# EAGLE design AVC_1_0 (EAGLE 8.3.2)
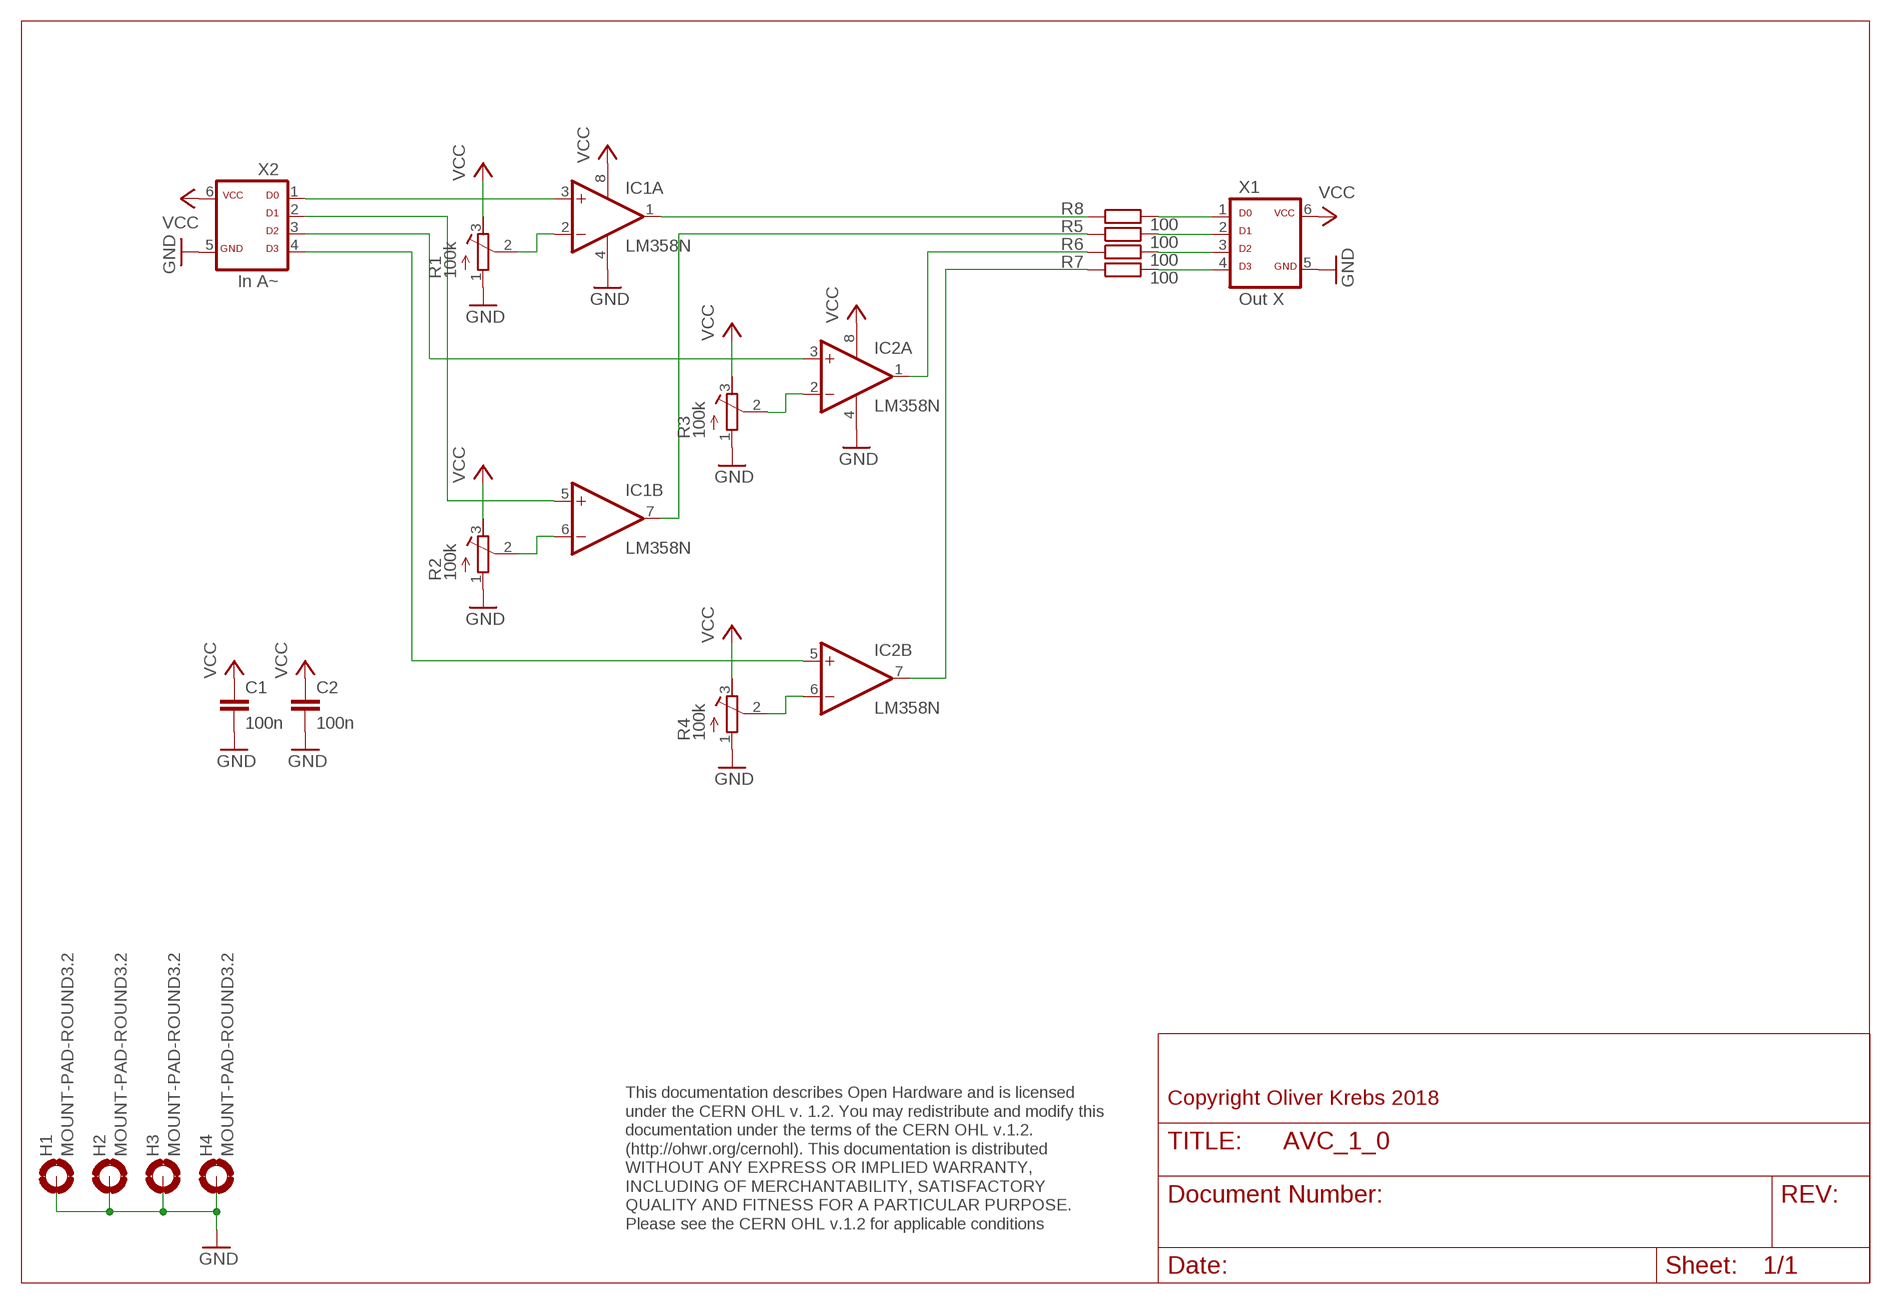
[diagram p0: schematic, sheet 1]

## Parts
C1  100n  C-EU050-025X075  [C050-025X075]
C2  100n  C-EU050-025X075  [C050-025X075]
H1  MOUNT-PAD-ROUND3.2  [3,2-PAD]
H2  MOUNT-PAD-ROUND3.2  [3,2-PAD]
H3  MOUNT-PAD-ROUND3.2  [3,2-PAD]
H4  MOUNT-PAD-ROUND3.2  [3,2-PAD]
IC1  LM358N  [DIL08]
IC2  LM358N  [DIL08]
R1  100k  R-TRIMMACP  [ACP-6L]
R2  100k  R-TRIMMACP  [ACP-6L]
R3  100k  R-TRIMMACP  [ACP-6L]
R4  100k  R-TRIMMACP  [ACP-6L]
R5  100  R-EU_0207/10  [0207/10]
R6  100  R-EU_0207/10  [0207/10]
R7  100  R-EU_0207/10  [0207/10]
R8  100  R-EU_0207/10  [0207/10]
X1  Out X  ML6D  [ML-6]
X2  In A~  ML6D  [ML-6]

## Nets
GND: C1.2 C2.2 H1.B3,2(MOUNT) H2.B3,2(MOUNT) H3.B3,2(MOUNT) H4.B3,2(MOUNT) IC1.4(P:V-) IC2.4(P:V-) R1.1(A) R2.1(A) R3.1(A) R4.1(A) X1.5 X2.5
N$1: IC1.3(A:+IN) X2.1
N$2: IC1.2(A:-IN) R1.2(S)
N$3: IC1.5(B:+IN) X2.2
N$4: IC1.6(B:-IN) R2.2(S)
N$5: R5.2 X1.2
N$6: R8.2 X1.1
N$7: R6.2 X1.3
N$8: R7.2 X1.4
N$9: IC1.1(A:OUT) R8.1
N$10: IC1.7(B:OUT) R5.1
N$11: IC2.3(A:+IN) X2.3
N$12: IC2.2(A:-IN) R3.2(S)
N$13: IC2.5(B:+IN) X2.4
N$14: IC2.6(B:-IN) R4.2(S)
N$15: IC2.1(A:OUT) R6.1
N$16: IC2.7(B:OUT) R7.1
VCC: C1.1 C2.1 IC1.8(P:V+) IC2.8(P:V+) R1.3(E) R2.3(E) R3.3(E) R4.3(E) X1.6 X2.6

## Notes on the sheet
- Copyright Oliver Krebs 2018
- This documentation describes Open Hardware and is licensed 
  under the CERN OHL v. 1.2. You may redistribute and modify this 
  documentation under the terms of the CERN OHL v.1.2. 
  (http://ohwr.org/cernohl). This documentation is distributed
  WITHOUT ANY EXPRESS OR IMPLIED WARRANTY, 
  INCLUDING OF MERCHANTABILITY, SATISFACTORY 
  QUALITY AND FITNESS FOR A PARTICULAR PURPOSE. 
  Please see the CERN OHL v.1.2 for applicable conditions

## Library data of the parts
C1 C2 = 01-my_rcl:C-EU: CAPACITOR, European symbol
H1-H4 = holes:MOUNT-PAD-ROUND: MOUNTING PAD, round
IC1 IC2 = 01-my-linear:LM358: OP AMP also LM158; LM258; LM2904 Source: http://cache.national.com/ds/LM/LM158.pdf
R1-R4 = 01-my_rcl:R-TRIMM: Trimm resistor
R5-R8 = 01-my_rcl:R-EU_: RESISTOR, European symbol
X1 X2 = 01-my-con:ML6D

## Board
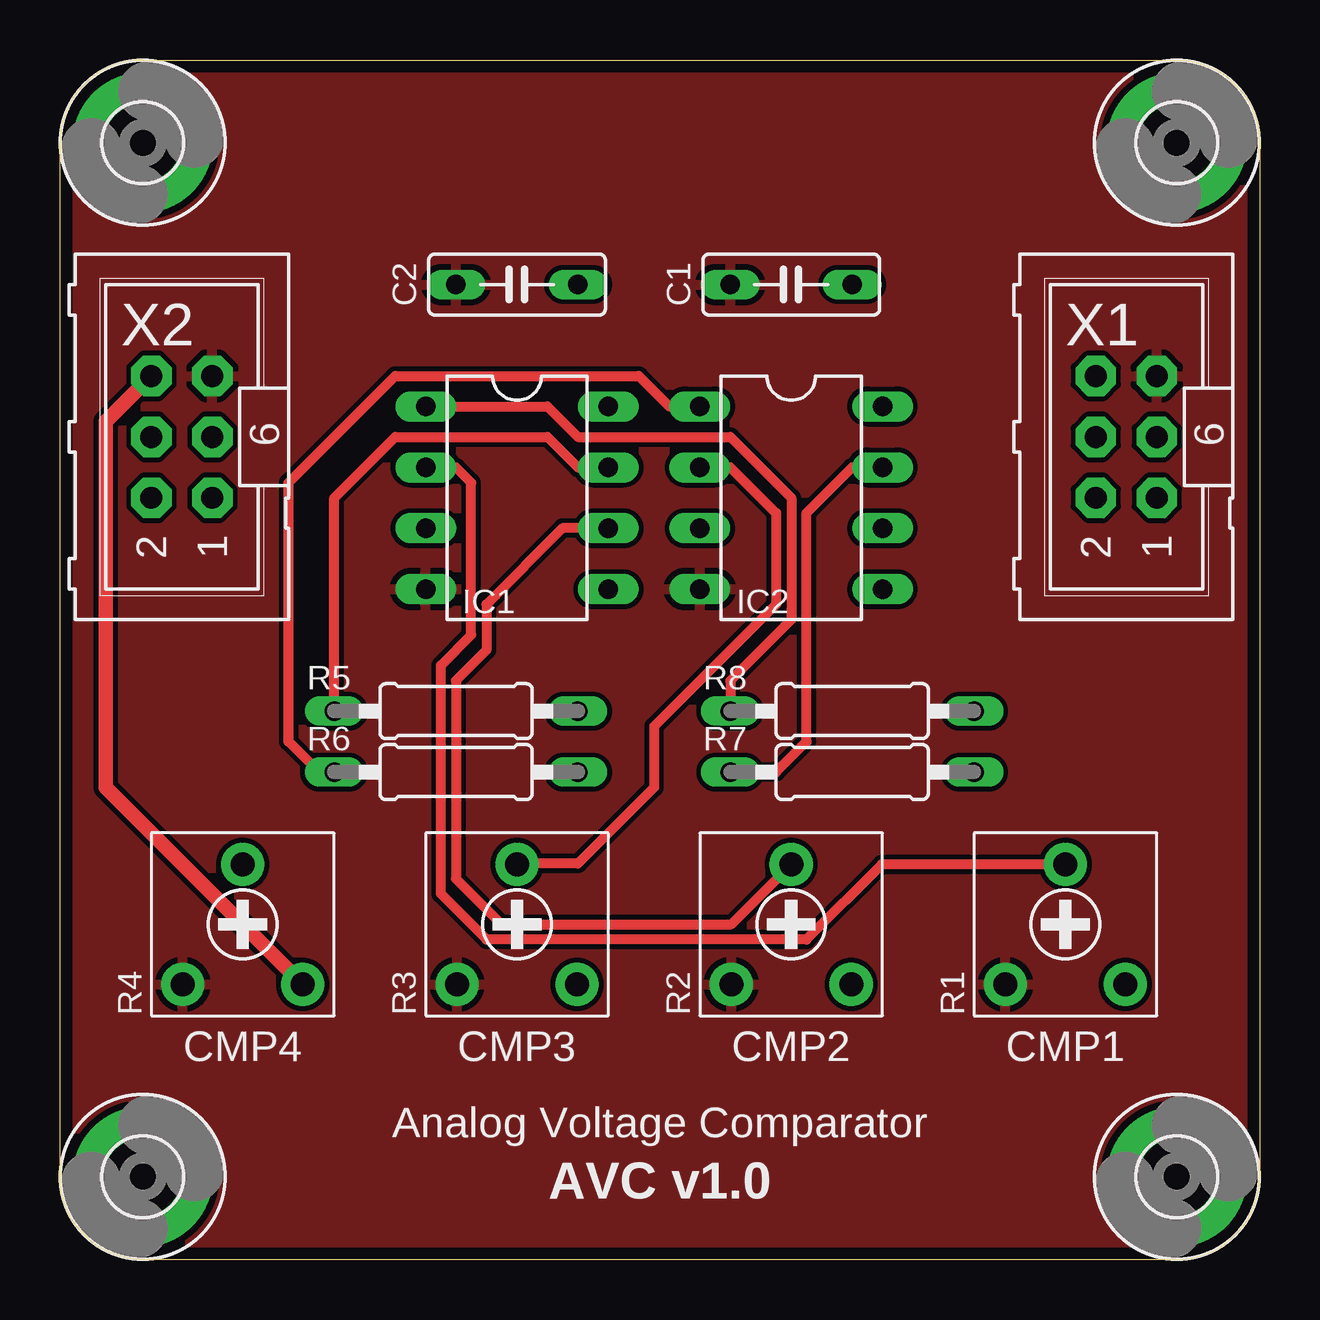
[diagram p1: board, top side]
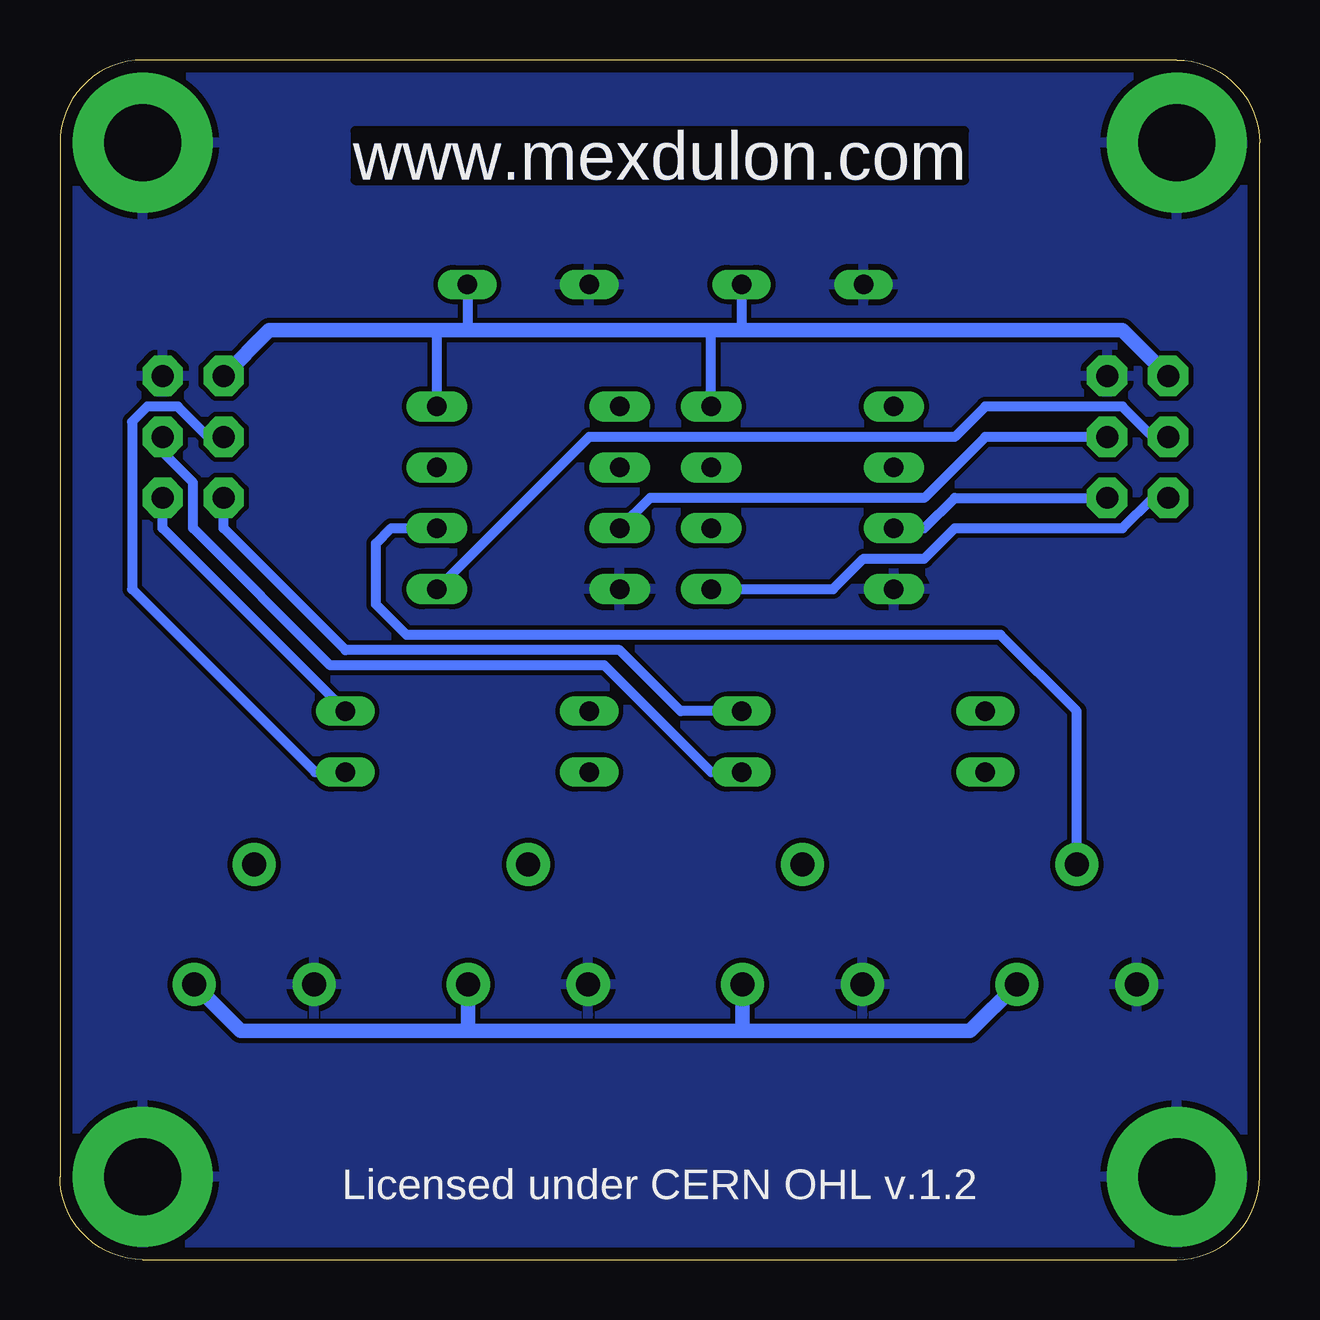
[diagram p2: board, bottom side, seen from below]

Size 50 x 50 mm. Coordinates in mm from the lower left corner, seen from the top.
Outline: 0,3.45 0,46.55 arc-90 3.45,50 46.55,50 arc-90 50,46.55 50,3.45 arc-90 46.55,0 3.45,0 arc-90 0,3.45
Copper layers (1*16): Top 0.035mm / dielectric 1.6mm / Bottom 0.035mm
Design rules "Elecrow_2-layer_PCB_eagle_rule_8mil": minimum track width 8mil, minimum drill 12mil, track to track 8mil, track to pad 8mil, pad to pad 8mil, via to via 8mil, smd to smd 0mil, copper to edge 20mil, drill to drill 10mil, minimum pad ring 6mil, minimum via ring 6mil, stop-mask expansion 0mil, vias tented up to drill 100mil, thermal gap 10mil

### Footprints (pad centres in the part's own frame; a part is rotated, then mirrored left to right if it is on the bottom)
C050-025X075 = drill 0.813 long: 1 -2.54,0; 2 2.54,0
3,2-PAD = drill 3.2 pad 5.842: B3,2 0,0
DIL08 = drill 0.813 pad 1.27 long: 1 -3.81,-3.81; 2 -1.27,-3.81; 3 1.27,-3.81; 4 3.81,-3.81; 5 3.81,3.81; 6 1.27,3.81; 7 -1.27,3.81; 8 -3.81,3.81
ACP-6L = drill 1 pad 1.8: 1 -2.5,-2.5; 2 0,2.5; 3 2.5,-2.5
0207/10 = drill 0.813 long: 1 -5.08,0; 2 5.08,0
ML-6 = drill 0.914 pad 1.676 octagon: 1 -2.54,-1.27; 2 -2.54,1.27; 3 0,-1.27; 4 0,1.27; 5 2.54,-1.27; 6 2.54,1.27

### Placement (x,y rotation side)
C1  30.48,40.64 180 top
C2  19.05,40.64 180 top
H1  3.45,3.45 0 top
H2  3.45,46.55 0 top
H3  46.55,46.55 0 top
H4  46.55,3.45 0 top
IC1  19.05,31.75 270 top
IC2  30.48,31.75 270 top
R1  41.91,13.97 0 top
R2  30.48,13.97 0 top
R3  19.05,13.97 0 top
R4  7.62,13.97 0 top
R5  16.51,22.86 0 top
R6  16.51,20.32 0 top
R7  33.02,20.32 0 top
R8  33.02,22.86 0 top
X1  44.45,34.29 90 top
X2  5.08,34.29 90 top

### Tracks (layer width: path | path; a pad name or v marks a point on that pad's centre or on a via)
GND
  pour Bottom (isolate 0.203): 0,50.16 50.8,50.16 50.8,0 0,0
  pour Top (isolate 0.203): 0,50.16 50.8,50.16 50.8,0 0,0
N$1
  Bottom 0.406: IC1.3 13.97,30.48 12.7,31.75 X2.1
N$2
  Top 0.406: R1.2 34.25,16.47 31.11,13.34 17.78,13.34 15.88,15.24 15.88,24.77 17.14,26.04 17.14,32.38 16.51,33.02 IC1.2
N$3
  Bottom 0.406: IC1.5 17.78,27.94 16.51,29.21 13.97,29.21 12.7,30.48 5.71,30.48 4.45,31.75 X2.2
N$4
  Top 0.406: IC1.6 20.95,30.48 17.78,27.3 17.78,25.4 16.51,24.13 16.51,15.88 18.41,13.97 27.98,13.97 R2.2
N$5
  Bottom 0.406: R5.2 24.13,22.86 26.67,25.4 38.1,25.4 43.18,30.48 X1.2
N$6
  Bottom 0.406: R8.2 45.72,30.48 X1.1
N$7
  Bottom 0.406: R6.2 22.86,20.32 27.3,24.77 38.73,24.77 44.45,30.48 44.45,32.38 45.72,33.66 X1.3
N$8
  Bottom 0.406: X1.4 43.81,34.29 45.09,35.56 46.35,35.56 46.99,34.92 46.99,27.94 39.37,20.32 R7.2
N$9
  Top 0.406: IC1.1 20.32,35.56 21.59,34.29 27.94,34.29 30.48,31.75 30.48,26.67 27.94,24.13 R8.1
N$10
  Top 0.406: R5.1 11.43,31.75 13.97,34.29 20.32,34.29 21.59,33.02 IC1.7
N$11
  Bottom 0.406: X2.3 11.43,34.29 13.97,31.75 25.4,31.75 IC2.3
N$12
  Top 0.406: IC2.2 27.94,33.02 29.84,31.11 29.84,27.3 24.77,22.23 24.77,19.68 21.59,16.51 19.09,16.51 R3.2
N$13
  Bottom 0.406: X2.4 4.45,34.29 5.71,35.56 11.43,35.56 12.7,34.29 27.94,34.29 IC2.5
N$14
  Bottom 0.406: R4.2 7.62,22.86 10.79,26.04 35.56,26.04 36.83,27.3 36.83,29.84 36.2,30.48 IC2.6
N$15
  Top 0.406: R6.1 10.79,20.32 9.53,21.59 9.53,32.38 13.97,36.83 24.13,36.83 25.4,35.56 IC2.1
N$16
  Top 0.406: R7.1 29.84,20.32 31.11,21.59 31.11,31.11 33.02,33.02 IC2.7
VCC
  Top 0.61: R4.3 1.91,19.68 1.91,34.92 X2.6
  Bottom 0.406: 32.98,9.56 33.02,9.53 | 21.55,9.56 21.59,9.53 | C2.1 21.59,38.73 | IC1.8 22.86,38.73 | IC2.8 34.29,38.73 | C1.1 33.02,38.73
  Bottom 0.61: R4.3 12.06,9.53 21.59,9.53 33.02,9.53 42.47,9.53 R1.3 | R2.3 32.98,9.56 | R3.3 21.55,9.56 | X1.6 41.27,38.73 34.29,38.73 33.02,38.73 22.86,38.73 21.59,38.73 5.71,38.73 X2.6

### Text on the board
Bottom: www.mexdulon.com
tNames: CMP4 | CMP3 | CMP2 | CMP1 | Analog Voltage Comparator | AVC v1.0
bNames: www.mexdulon.com | Licensed under CERN OHL v.1.2
200bmp: E:/Bilder/Elektronik/Modulion/Mexdulon/mexdulon_50x50_pcb.bmp